# Altium schematic sheet Relay1_Block.SchDoc
size A4; SheetNumber: 6; SheetTotal: 9
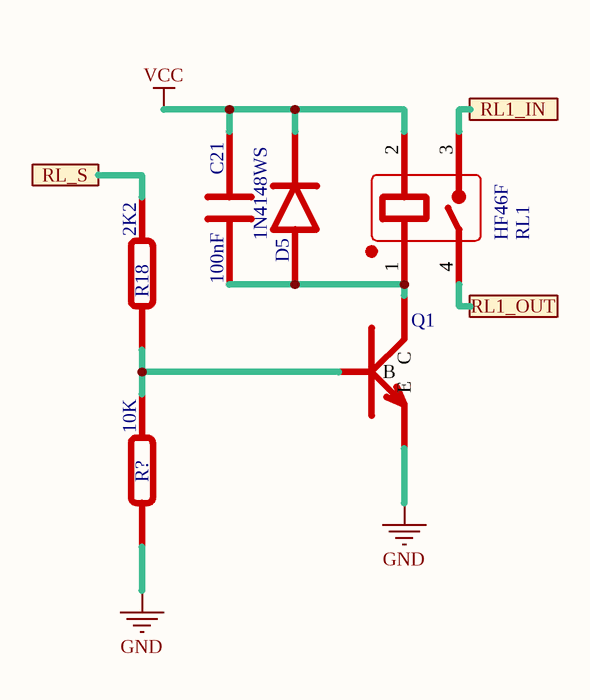
[diagram p0: Relay1_Block.SchDoc]

## Parts
C21  100nF  [C0805]
D5  1N4148WS  [SMA]
Q1  S8050  [SOT-23]  (value not drawn)
R18  2K2  [R0603]
R?  10K  [R0603]
RL1  HF46F  [HF-46-X]

## Ports
RL1_IN, RL1_OUT, RL_S

## Nets
GND: Q1.2(E) R?.2
VCC: C21.2 D5.K RL1.2
RL1_IN: RL1.3 ; port RL1_IN
RL1_OUT: RL1.4 ; port RL1_OUT
RL_S: R18.1 ; port RL_S
NetC21_1: C21.1 D5.A Q1.3(C) RL1.1
NetQ1_1: Q1.1(B) R18.2 R?.1

## Notes on the sheet
- Title
- Size:
- Date:
- A4
- Number:
- Time:
- Revision:
- Design by:
- Company:
- File:

## Library data of the parts
C21 = CAP-CER: Ceramic Capacitor
D5 = 1N4148WS: Small Signal Diode
Q1 = S8050: NPN Transistors 0.5A Collector to Emitter 25V
R18 R? = Resistor
RL1 = HF46F: Relay 4 Pin; ComponentLink1Description: HF-46F; ComponentLink1URL: https://source.hongfa.com/pdf/web/viewer.html?file=/Uploads/Product/PDF/HF46F_en.pdf